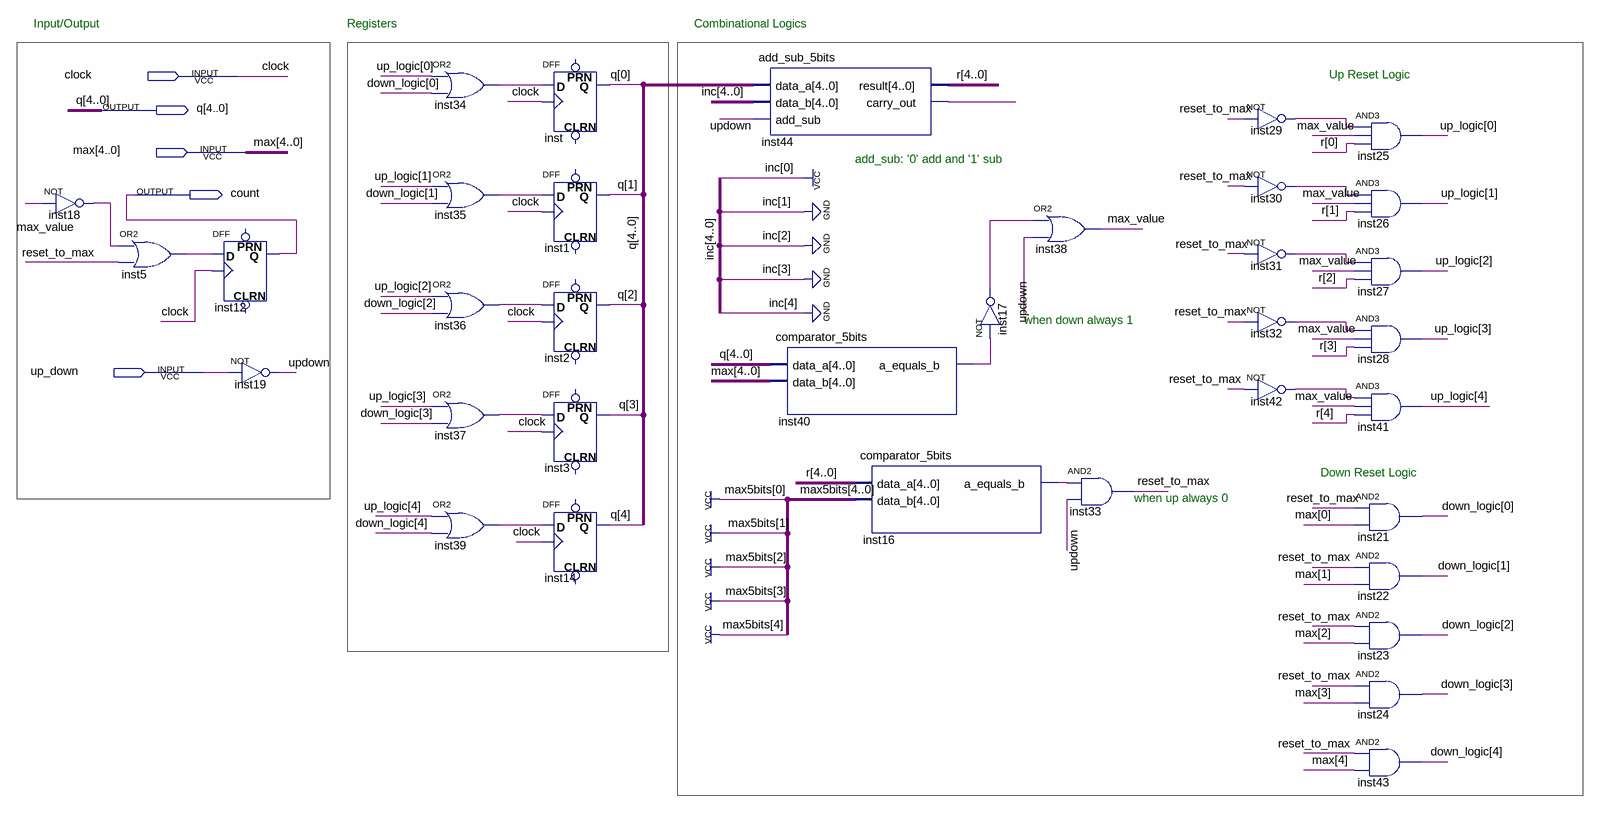
[diagram p0: schematic sheet]
// Quartus schematic generic_counter_5bits.bdf as structural Verilog: 35 symbols, 5 pins
module generic_counter_5bits (
  input  clock,
  input  [4:0] max,
  input  up_down,
  output [4:0] q,
  output count
);

  wire inst5_out, inst16_a_equals_b, inst17_out, inst18_out, inst29_out, inst30_out, inst31_out, inst32_out,
       inst34_out, inst35_out, inst36_out, inst37_out, inst39_out, inst40_a_equals_b, inst42_out,
       inst44_carry_out, max_value, reset_to_max, updown;
  wire [4:0] down_logic, r, up_logic;

  not inst18 (inst18_out, max_value);
  or inst5 (inst5_out, inst18_out, reset_to_max);
  DFF inst12 (.CLK(clock), .D(inst5_out), .Q(count));  // open: CLRN, PRN
  not inst19 (updown, up_down);
  or inst34 (inst34_out, up_logic[0], down_logic[0]);
  or inst35 (inst35_out, up_logic[1], down_logic[1]);
  or inst36 (inst36_out, up_logic[2], down_logic[2]);
  or inst37 (inst37_out, up_logic[3], down_logic[3]);
  or inst39 (inst39_out, up_logic[4], down_logic[4]);
  DFF inst (.CLK(clock), .D(inst34_out), .Q(q[0]));  // open: CLRN, PRN
  DFF inst1 (.CLK(clock), .D(inst35_out), .Q(q[1]));  // open: CLRN, PRN
  DFF inst2 (.CLK(clock), .D(inst36_out), .Q(q[2]));  // open: CLRN, PRN
  DFF inst3 (.CLK(clock), .D(inst37_out), .Q(q[3]));  // open: CLRN, PRN
  DFF inst14 (.CLK(clock), .D(inst39_out), .Q(q[4]));  // open: CLRN, PRN
  add_sub_5bits inst44 (.data_a(q), .data_b(5'b00001), .add_sub(updown), .result(r), .carry_out(inst44_carry_out));
  comparator_5bits inst40 (.data_a(q), .data_b(max), .a_equals_b(inst40_a_equals_b));
  comparator_5bits inst16 (.data_a(r), .data_b({5{1'b1}}), .a_equals_b(inst16_a_equals_b));
  not inst17 (inst17_out, inst40_a_equals_b);
  or inst38 (max_value, inst17_out, updown);
  and inst33 (reset_to_max, inst16_a_equals_b, updown);
  not inst29 (inst29_out, reset_to_max);
  not inst30 (inst30_out, reset_to_max);
  not inst31 (inst31_out, reset_to_max);
  not inst32 (inst32_out, reset_to_max);
  not inst42 (inst42_out, reset_to_max);
  and inst25 (up_logic[0], inst29_out, max_value, r[0]);
  and inst26 (up_logic[1], inst30_out, max_value, r[1]);
  and inst27 (up_logic[2], inst31_out, max_value, r[2]);
  and inst28 (up_logic[3], inst32_out, max_value, r[3]);
  and inst41 (up_logic[4], inst42_out, max_value, r[4]);
  and inst21 (down_logic[0], reset_to_max, max[0]);
  and inst22 (down_logic[1], reset_to_max, max[1]);
  and inst23 (down_logic[2], reset_to_max, max[2]);
  and inst24 (down_logic[3], reset_to_max, max[3]);
  and inst43 (down_logic[4], reset_to_max, max[4]);

  // Notes on the sheet:
  //   Input/Output
  //   Registers
  //   Combinational Logics
  //   Up Reset Logic
  //   add_sub: '0' add and '1' sub
  //   when down always 1
  //   Down Reset Logic
  //   when up always 0
endmodule
